# Altium project main.PrjPcb
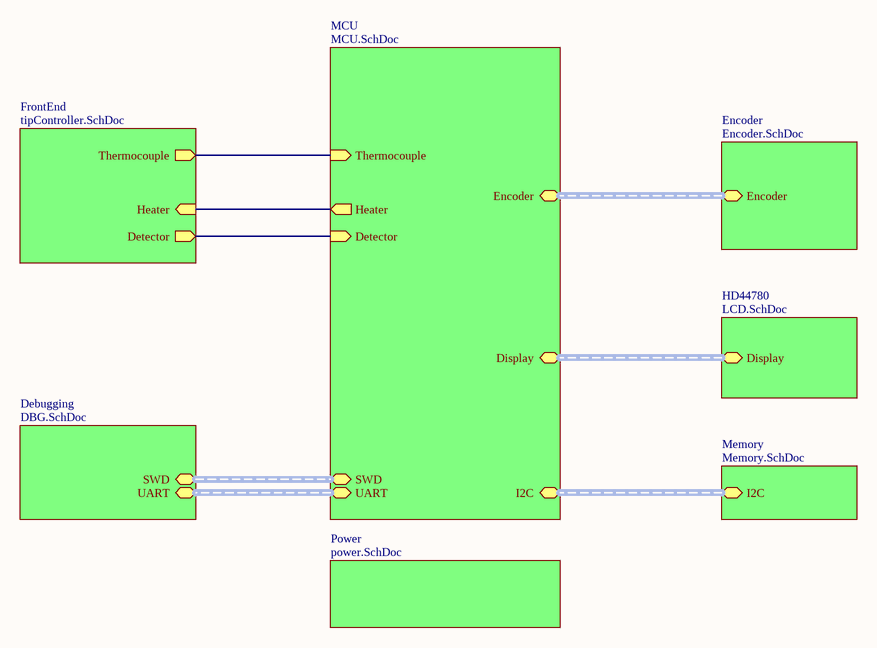
[diagram p0: top.SchDoc]
8 sheets, 80 parts. Net scope: hierarchical (ports join the sheet entries above them; power ports are global).
Board file: Main.PcbDoc
Sheets:
  top.SchDoc
    MCU = MCU.SchDoc
    Encoder = Encoder.SchDoc
    FrontEnd = tipController.SchDoc
    HD44780 = LCD.SchDoc
    Power = power.SchDoc
    Debugging = DBG.SchDoc
    Memory = Memory.SchDoc

## Sheet top.SchDoc: Weller RT soldering station
size A4; DrawnBy: Grzegorz Gajoch; Address1: Grzegorz Gajoch; Address2: grzegorz@gajoch.pl; Revision: 1

### Sub-sheets
Debugging = DBG.SchDoc: SWD (harness SWD), UART (harness UART)
Encoder = Encoder.SchDoc: Encoder (harness Encoder)
FrontEnd = tipController.SchDoc: Thermocouple (out), Heater (in), Detector (out)
HD44780 = LCD.SchDoc: Display (harness Display)
MCU = MCU.SchDoc: Display (harness Display), Thermocouple (in), Encoder (harness Encoder), Heater (out), SWD (harness SWD), UART (harness UART), Detector (in), I2C (harness I2C)
Memory = Memory.SchDoc: I2C (harness I2C)
Power = power.SchDoc: no entries

### Nets
NetC19_1: sheet MCU/Thermocouple, sheet FrontEnd/Thermocouple
NetR25_1: sheet MCU/Detector, sheet FrontEnd/Detector
NetR26_1: sheet MCU/Heater, sheet FrontEnd/Heater

### Buses and harness runs
harness sheet Debugging/SWD = sheet MCU/SWD
harness sheet Debugging/UART = sheet MCU/UART
harness sheet Encoder/Encoder = sheet MCU/Encoder
harness sheet HD44780/Display = sheet MCU/Display
harness sheet MCU/I2C = sheet Memory/I2C

### Notes on the sheet
- Title
- Size:
- Date:
- A4
- Number:
- Time:
- Revision:
- Sheet
- of
- File:

## Sheet MCU.SchDoc: MCU
size A4; DrawnBy: Grzegorz Gajoch; Address1: Grzegorz Gajoch; Address2: grzegorz@gajoch.pl; Revision: 1
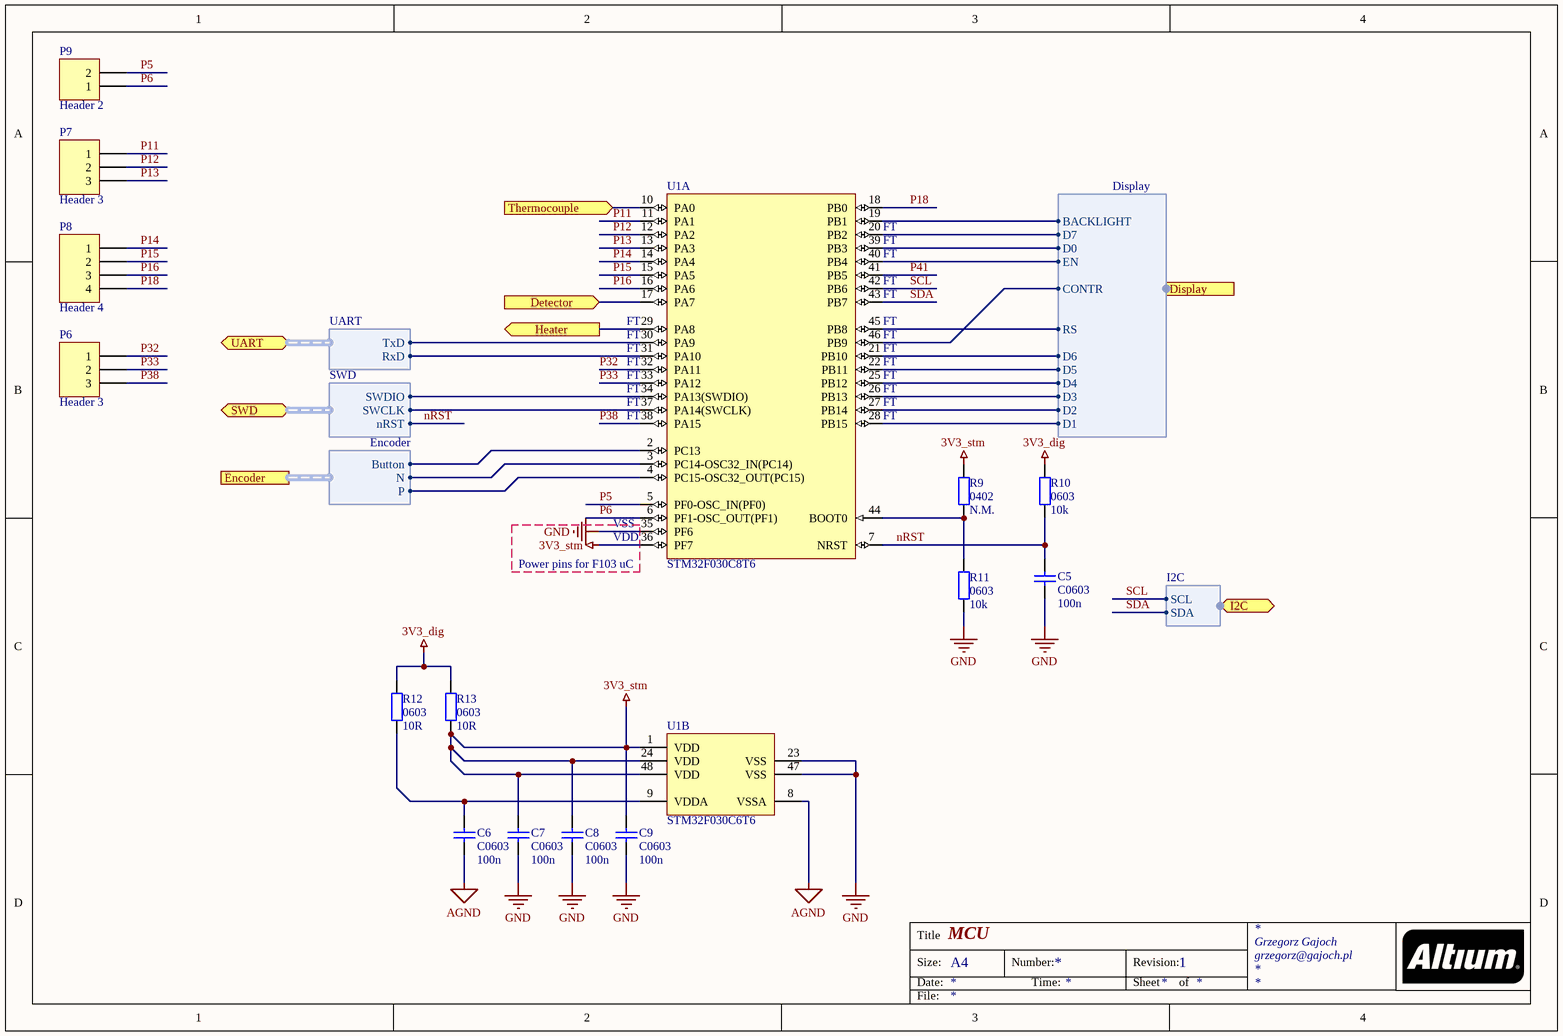
[diagram p1: MCU.SchDoc]

### Parts
C5  100n  [C0603]
C6  100n  [C0603]
C7  100n  [C0603]
C8  100n  [C0603]
C9  100n  [C0603]
P6  Header 3  [HEADER 1X3 MALE]
P7  Header 3  [HEADER 1X3 MALE]
P8  Header 4  [HEADER 1x4 MALE]
P9  Header 2  [HEADER 1X2 Male]
R9  N.M.  [0402]
R10  10k  [0603]
R11  10k  [0603]
R12  10R  [0603]
R13  10R  [0603]
U1  STM32F030C8T6  [QFP_48_0.5_M]  (parts A,B of 2)

### Ports
Detector (in), Display (harness Display), Encoder (harness Encoder), Heater (out), I2C (harness I2C), SWD (harness SWD), Thermocouple (in), UART (harness UART)

### Harnesses
SWD: SWDIO, SWCLK, nRST
Display: CONTR, RS, EN, D0, D1, D2, D3, D4, D5, D6, D7, BACKLIGHT
UART: RxD, TxD
Encoder: Button, P, N
I2C: SCL, SDA

### Nets
3V3_dig: R10.1 R12.1 R13.1
3V3_stm: C7.1 C8.1 C9.1 R9.1 R13.2 U1.1(VDD) U1.24(VDD) U1.36(PF7) U1.48(VDD)
AGND: C6.2 U1.8(VSSA)
GND: C5.2 C7.2 C8.2 C9.2 R11.2 U1.23(VSS) U1.35(PF6) U1.47(VSS)
BACK: U1.19(PB1) ; port Display.BACKLIGHT
BTN: U1.2(PC13) ; port Encoder.Button
D0: U1.39(PB3) ; port Display.D0
D1: U1.28(PB15) ; port Display.D1
D2: U1.27(PB14) ; port Display.D2
D3: U1.26(PB13) ; port Display.D3
D4: U1.25(PB12) ; port Display.D4
D5: U1.22(PB11) ; port Display.D5
D6: U1.21(PB10) ; port Display.D6
D7: U1.20(PB2) ; port Display.D7
ENx: U1.40(PB4) ; port Display.EN
nRST: C5.1 R10.2 U1.7(NRST) ; port SWD.nRST
P5: P9.2 U1.5(PF0-OSC_IN(PF0))
P6: P9.1 U1.6(PF1-OSC_OUT(PF1))
P11: P7.1 U1.11(PA1)
P12: P7.2 U1.12(PA2)
P13: P7.3 U1.13(PA3)
P14: P8.1 U1.14(PA4)
P15: P8.2 U1.15(PA5)
P16: P8.3 U1.16(PA6)
P18: P8.4 U1.18(PB0)
P32: P6.1 U1.32(PA11)
P33: P6.2 U1.33(PA12)
P38: P6.3 U1.38(PA15)
P41: U1.41(PB5)
RS: U1.45(PB8) ; port Display.RS
SCL: U1.42(PB6) ; port I2C.SCL
SDA: U1.43(PB7) ; port I2C.SDA
NetC1_1: U1.3(PC14-OSC32_IN(PC14)) ; port Encoder.N
NetC2_1: U1.4(PC15-OSC32_OUT(PC15)) ; port Encoder.P
NetC6_1: C6.1 R12.2 U1.9(VDDA)
NetC19_1: U1.10(PA0) ; port Thermocouple
NetP1_2: U1.31(PA10) ; port UART.RxD
NetP1_3: U1.30(PA9) ; port UART.TxD
NetP2_2: U1.37(PA14(SWCLK)) ; port SWD.SWCLK
NetP2_4: U1.34(PA13(SWDIO)) ; port SWD.SWDIO
NetR7_1: U1.46(PB9) ; port Display.CONTR
NetR9_2: R9.2 R11.1 U1.44(BOOT0)
NetR25_1: U1.17(PA7) ; port Detector
NetR26_1: U1.29(PA8) ; port Heater

### Notes on the sheet
- (near U1) FT
- (near U1) Power pins for F103 uC
- (near U1) VSS
- (near U1) VDD
- Title
- Size:
- Date:
- A4
- Number:
- Time:
- Revision:
- Sheet
- of
- File:

### Library data of the parts
C5-C9 = Cap: Generic capacitor; Packge: C0603; Value: 100n
P6 P7 = Header 3: Header, 3-Pin; LatestRevisionDate: 17-Jul-2002; LatestRevisionNote: Re-released for DXP Platform.; Publisher: Altium Limited
P8 = Header 4: Header, 4-Pin; LatestRevisionDate: 17-Jul-2002; LatestRevisionNote: Re-released for DXP Platform.; Publisher: Altium Limited
P9 = Header 2: Header, 2-Pin; LatestRevisionDate: 17-Jul-2002; LatestRevisionNote: Re-released for DXP Platform.; Publisher: Altium Limited
R9-R13 = Res: Generic resistor
  R9: Package: 0402; Value: N.M.
  R10 R11: Package: 0603; Value: 10k
  R12 R13: Package: 0603; Value: 10R
U1 = STM32F030C6T6: ARM Cortex-M0 32-bit MCU, 32 KB Flash, 4 KB Internal RAM, 39 I/Os, 48-pin LQFP, -40 to 85 degC, Tray; FLASH Size (Prog) (kB): 32; I/Os (High Current): 39; Internal RAM Size (kB): 4; Operating Frequency(F) (Processor speed) (MHz): 48; Supply Voltage(Vcc) min (V): 2.4; DatasheetVersion: Rev. 1; PackageVersion: Rev. 6, 06/2013; PackageReference: LQFP48; PackageDescription: 48-Pin Low Profile Quad Flat Package, 7 x 7 mm Body, 0.5 mm Pitch; Supplier 1: Digi-Key; Supplier Part Number 1: 497-14042-ND; Supplier 2: Newark; Supplier Part Number 2: 06X3646; Supplier 3: Mouser; Supplier Part Number 3: 511-STM32F030C6T6; Core: ARM Cortex-M0; Packing: Tray; Mounting Technology: Surface Mount; PartNumber: STM32F030C6T6; ComponentLink1Description: Manufacturer URL; ComponentLink1URL: http://www.st.com/web/en/home.html; ComponentLink2Description: Datasheet; ComponentLink2URL: http://www.st.com/st-web-ui/static/active/en/resource/technical/document/datasheet/DM00088500.pdf; ComponentLink3Description: Package Specification; ComponentLink3URL: http://www.st.com/st-web-ui/static/active/en/resource/technical/document/datasheet/DM00058181.pdf

## Sheet Encoder.SchDoc: Encoder connector
size A4; DrawnBy: Grzegorz Gajoch; Address1: Grzegorz Gajoch; Address2: grzegorz@gajoch.pl; Revision: 1
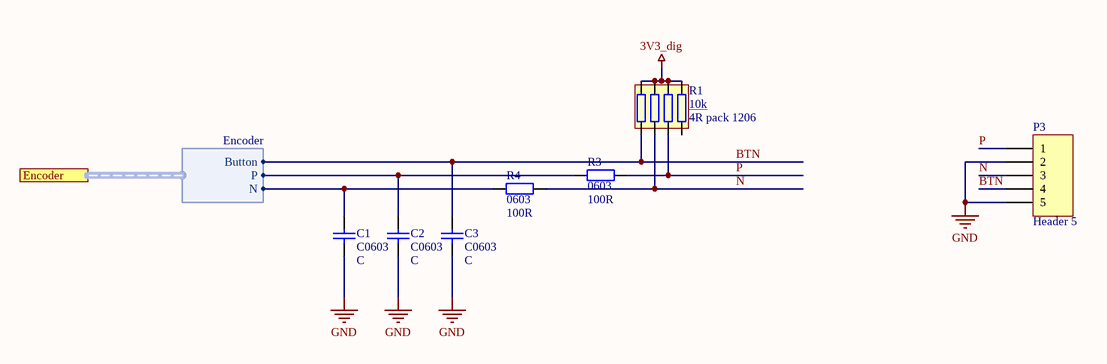
[diagram p2: Encoder.SchDoc]

### Parts
C1  C  [C0603]
C2  C  [C0603]
C3  C  [C0603]
P3  Header 5  [HDR1X5]
R1  10k  [4R pack 1206]
R3  100R  [0603]
R4  100R  [0603]

### Ports
Encoder (harness Encoder)

### Harnesses
Encoder: Button, P, N

### Nets
3V3_dig: R1.5 R1.6 R1.7 R1.8
GND: C1.2 C2.2 C3.2 P3.2 P3.5
BTN: C3.1 P3.4 R1.4 ; port Encoder.Button
N: P3.3 R1.3 R4.2
P: P3.1 R1.2 R3.2
NetC1_1: C1.1 R4.1 ; port Encoder.N
NetC2_1: C2.1 R3.1 ; port Encoder.P

Not connected (* = marked no-connect by the designer): R1 1

### Notes on the sheet
- Title
- Size:
- Date:
- A4
- Number:
- Time:
- Revision:
- Sheet
- of
- File:

### Library data of the parts
C1-C3 = Cap: Generic capacitor; Packge: C0603; Value: C
P3 = Header 5: Header, 5-Pin; LatestRevisionDate: 17-Jul-2002; LatestRevisionNote: Re-released for DXP Platform.; Publisher: Altium Limited
R1 = Rres_pack_4: 4 resistor pack array; Value: 10k; Package: 4R pack 1206
R3 R4 = Res: Generic resistor; Package: 0603; Value: 100R

## Sheet tipController.SchDoc: Weller RT controller analog
size A3; DrawnBy: Grzegorz Gajoch; Address1: Grzegorz Gajoch; Address2: grzegorz@gajoch.pl; Revision: 1
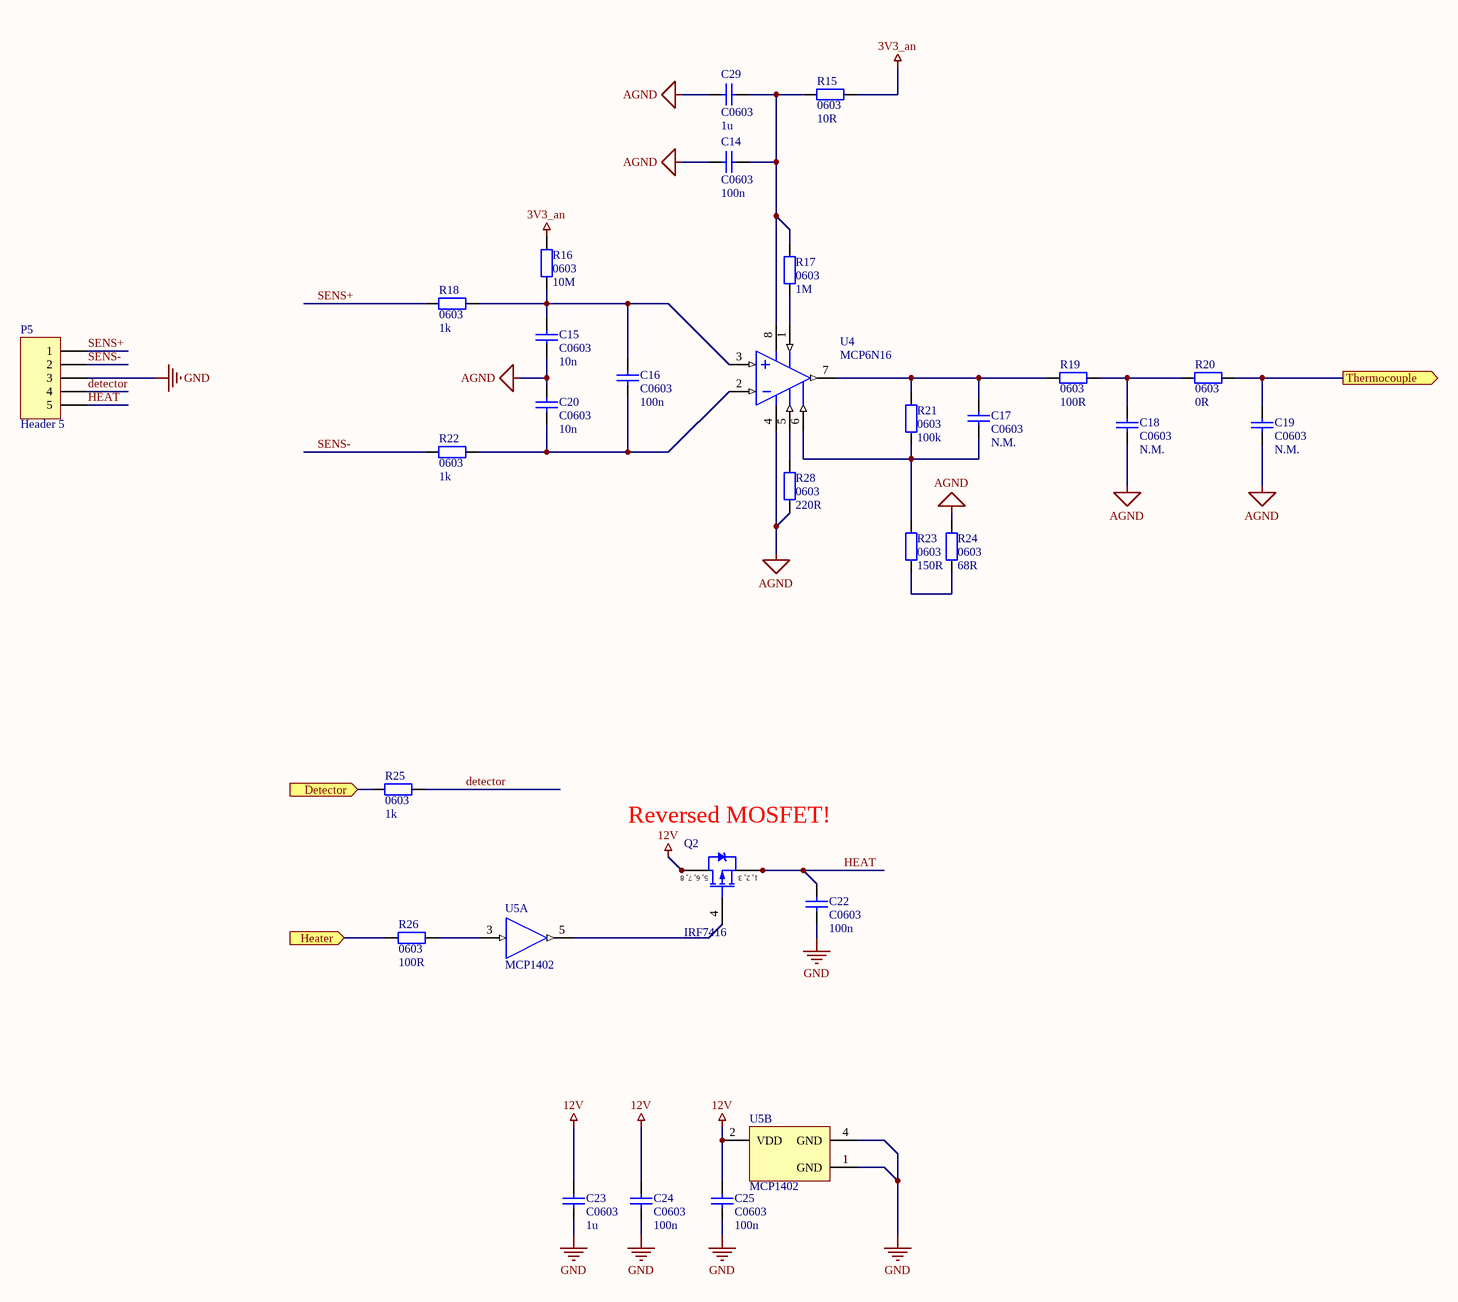
[diagram p3: tipController.SchDoc]

### Parts
C14  100n  [C0603]
C15  10n  [C0603]
C16  100n  [C0603]
C17  N.M.  [C0603]
C18  N.M.  [C0603]
C19  N.M.  [C0603]
C20  10n  [C0603]
C22  100n  [C0603]
C23  1u  [C0603]
C24  100n  [C0603]
C25  100n  [C0603]
C29  1u  [C0603]
P5  Header 5  [HDR1X5]
Q2  IRF7416  [SOIC-8_M]
R15  10R  [0603]
R16  10M  [0603]
R17  1M  [0603]
R18  1k  [0603]
R19  100R  [0603]
R20  0R  [0603]
R21  100k  [0603]
R22  1k  [0603]
R23  150R  [0603]
R24  68R  [0603]
R25  1k  [0603]
R26  100R  [0603]
R28  220R  [0603]
U4  MCP6N16  [MSOP-MS8_M]
U5  MCP1402  [SOT23-5_M]  (parts A,B of 2)

### Ports
Detector (in), Heater (in), Thermocouple (out)

### Nets
3V3_an: R15.1 R16.1
12V: C23.1 C24.1 C25.1 Q2.5(D) Q2.6(D) Q2.7(D) Q2.8(D) U5.2(VDD)
AGND: C14.1 C15.1 C18.2 C19.2 C20.1 C29.2 R24.2 R28.2 U4.4(VSS)
GND: C22.2 C23.2 C24.2 C25.2 P5.3 U5.1(GND) U5.4(GND)
detector: P5.4 R25.2
HEAT: C22.1 P5.5 Q2.1(S) Q2.2(S) Q2.3(S)
SENS+: P5.1 R18.1
SENS-: P5.2 R22.1
NetC14_2: C14.2 C29.1 R15.2 R17.1 U4.8(VDD)
NetC15_2: C15.2 C16.1 R16.2 R18.2 U4.3(VIN+)
NetC16_2: C16.2 C20.2 R22.2 U4.2(VIN-)
NetC17_1: C17.1 R19.1 R21.1 U4.7(VOUT)
NetC17_2: C17.2 R21.2 R23.1 U4.6(FB)
NetC18_1: C18.1 R19.2 R20.1
NetC19_1: C19.1 R20.2 ; port Thermocouple
NetQ2_4: Q2.4(G) U5.5(OUT)
NetR17_2: R17.2 U4.1(EN)
NetR23_2: R23.2 R24.1
NetR25_1: R25.1 ; port Detector
NetR26_1: R26.1 ; port Heater
NetR26_2: R26.2 U5.3(IN)
NetR28_1: R28.1 U4.5(Vref)

### Notes on the sheet
- (near Q2) Reversed MOSFET!
- Title
- Size:
- Date:
- A3
- Number:
- Time:
- Revision:
- Sheet
- of
- File:
- (in symbol IRF7416) 5, 6, 7, 8; 1, 2, 3

### Library data of the parts
C14-C20 C22-C25 C29 = Cap: Generic capacitor; Packge: C0603
  C14 C16 C22 C24 C25: Value: 100n
  C15 C20: Value: 10n
  C17-C19: Value: N.M.
  C23 C29: Value: 1u
P5 = Header 5: Header, 5-Pin; LatestRevisionDate: 17-Jul-2002; LatestRevisionNote: Re-released for DXP Platform.; Publisher: Altium Limited
Q2 = IRF7416: Power P-MOSFET; Published: 8-Jun-2000; LatestRevisionDate: 13-Apr-2006; LatestRevisionNote: IPC-7351 Footprint Added.; DatasheetVersion: Aug-1997; PackageVersion: Feb-2001; PackageReference: SO-8; Publisher: Altium Limited; PackageDescription: 8-Pin Plastic Small Outline Integrated Circuit 1.27 mm Pitch; Code_JEDEC: MS-012-AA; Code_IPC: SOIC127P600-8; ComponentLink1Description: Manufacturer Link; ComponentLink1URL: http://www.irf.com/; ComponentLink2Description: Datasheet; ComponentLink2URL: http://www.irf.com/product-info/datasheets/data/irf7416.pdf
R15-R26 R28 = Res: Generic resistor; Package: 0603
  R15: Value: 10R
  R16: Value: 10M
  R17: Value: 1M
  R18 R22 R25: Value: 1k
  R19 R26: Value: 100R
  R20: Value: 0R
  R21: Value: 100k
  R23: Value: 150R
  R24: Value: 68R
  R28: Value: 220R
U5 = MCP1402: MCP1402 MOSFET driver
U4 = MCP6N16: ComponentLink1URL: http://ww1.microchip.com/downloads/en/DeviceDoc/20005318A.pdf; ComponentLink1Description: Datasheet

## Sheet LCD.SchDoc: HD44780 display connector
size A4; DrawnBy: Grzegorz Gajoch; Address1: Grzegorz Gajoch; Address2: grzegorz@gajoch.pl; Revision: 1
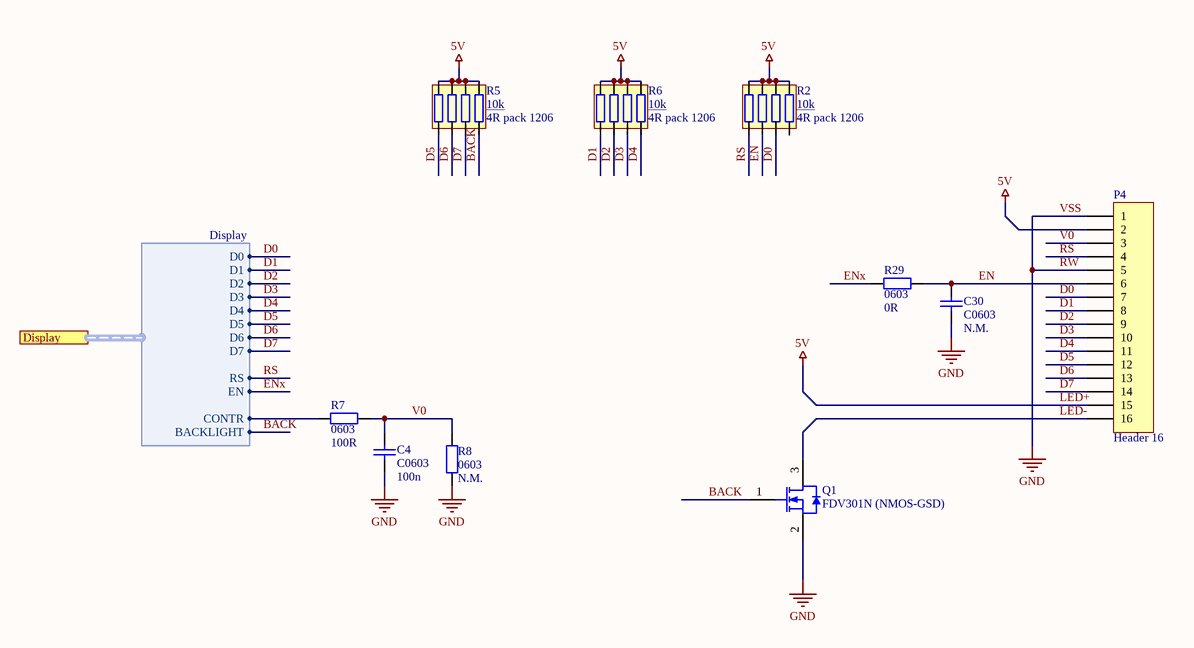
[diagram p4: LCD.SchDoc]

### Parts
C4  100n  [C0603]
C30  N.M.  [C0603]
P4  Header 16  [HEADER 1X16 Female]
Q1  FDV301N (NMOS-GSD)  [SOT-23_M]
R2  10k  [4R pack 1206]
R5  10k  [4R pack 1206]
R6  10k  [4R pack 1206]
R7  100R  [0603]
R8  N.M.  [0603]
R29  0R  [0603]

### Ports
Display (harness Display)

### Harnesses
Display: CONTR, RS, EN, D0, D1, D2, D3, D4, D5, D6, D7, BACKLIGHT

### Nets
GND: C4.2 C30.2 P4.1 P4.5 Q1.2(S) R8.2
LED+: P4.2 P4.15 R2.5 R2.6 R2.7 R2.8 R5.5 R5.6 R5.7 R5.8 R6.5 R6.6 R6.7 R6.8  [also labelled 5V]
BACK: Q1.1(G) R5.4 ; port Display.BACKLIGHT
D0: P4.7 R2.3 ; port Display.D0
D1: P4.8 R6.1 ; port Display.D1
D2: P4.9 R6.2 ; port Display.D2
D3: P4.10 R6.3 ; port Display.D3
D4: P4.11 R6.4 ; port Display.D4
D5: P4.12 R5.1 ; port Display.D5
D6: P4.13 R5.2 ; port Display.D6
D7: P4.14 R5.3 ; port Display.D7
EN: C30.1 P4.6 R2.2 R29.2
ENx: R29.1 ; port Display.EN
LED-: P4.16 Q1.3(D)
RS: P4.4 R2.1 ; port Display.RS
V0: C4.1 P4.3 R7.2 R8.1
NetR7_1: R7.1 ; port Display.CONTR

Not connected (* = marked no-connect by the designer): R2 4

### Notes on the sheet
- (near P4) VSS
- (near P4) RW
- Title
- Size:
- Date:
- A4
- Number:
- Time:
- Revision:
- Sheet
- of
- File:

### Library data of the parts
C4 C30 = Cap: Generic capacitor; Packge: C0603
  C4: Value: 100n
  C30: Value: N.M.
P4 = Header 16: Header, 16-Pin; LatestRevisionDate: 17-Jul-2002; LatestRevisionNote: Re-released for DXP Platform.; Publisher: Altium Limited
Q1 = NMOS-GSD
R2 R5 R6 = Rres_pack_4: 4 resistor pack array; Value: 10k; Package: 4R pack 1206
R7 R8 R29 = Res: Generic resistor; Package: 0603
  R7: Value: 100R
  R8: Value: N.M.
  R29: Value: 0R

## Sheet power.SchDoc: Power distribution
size A4; DrawnBy: Grzegorz Gajoch; Address1: Grzegorz Gajoch; Address2: grzegorz@gajoch.pl; Revision: 1
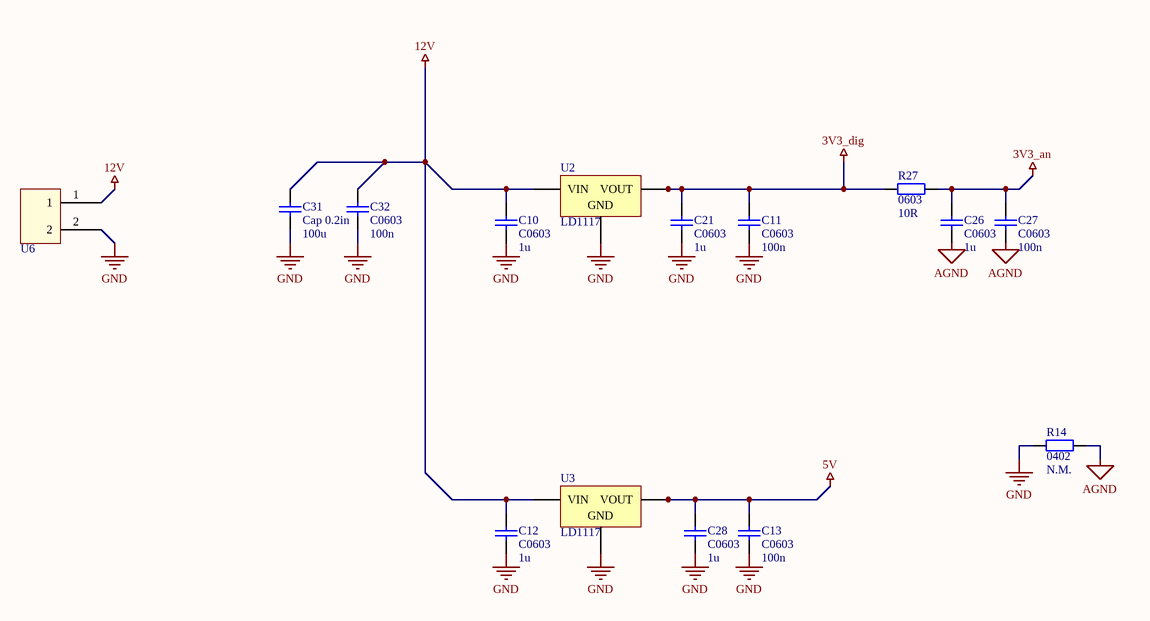
[diagram p5: power.SchDoc]

### Parts
C10  1u  [C0603]
C11  100n  [C0603]
C12  1u  [C0603]
C13  100n  [C0603]
C21  1u  [C0603]
C26  1u  [C0603]
C27  100n  [C0603]
C28  1u  [C0603]
C31  100u  [Cap 0.2in]
C32  100n  [C0603]
R14  N.M.  [0402]
R27  10R  [0603]
U2  LD1117  [TO-252]
U3  LD1117  [TO-252]
U6  ARK Terminal Block; 2-pin  [ARK2]  (value not drawn)

### Nets
3V3_an: C26.1 C27.1 R27.2
3V3_dig: C11.1 C21.1 R27.1 U2.2(VOUT) U2.4(VOUT) U2.5(VOUT) U2.6(VOUT)
5V: C13.1 C28.1 U3.2(VOUT) U3.4(VOUT) U3.5(VOUT) U3.6(VOUT)  [project net LED+]
12V: C10.1 C12.1 C31.1 C32.1 U2.3(VIN) U3.3(VIN) U6.1
AGND: C26.2 C27.2 R14.2
GND: C10.2 C11.2 C12.2 C13.2 C21.2 C28.2 C31.2 C32.2 R14.1 U2.1(GND) U3.1(GND) U6.2

### Notes on the sheet
- Title
- Size:
- Date:
- A4
- Number:
- Time:
- Revision:
- Sheet
- of
- File:

### Library data of the parts
C10-C13 C21 C26-C28 C31 C32 = Cap: Generic capacitor
  C10 C12 C21 C26 C28: Packge: C0603; Value: 1u
  C11 C13 C27 C32: Packge: C0603; Value: 100n
  C31: Packge: Cap 0.2in; Value: 100u
R14 R27 = Res: Generic resistor
  R14: Package: 0402; Value: N.M.
  R27: Package: 0603; Value: 10R
U2 U3 = LD1117: Low drop positive voltage regulator; pin to pad: 2>4 5>4 6>4; ComponentLink1URL: http://www.st.com/web/en/resource/technical/document/datasheet/CD00000544.pdf; ComponentLink1Description: Datasheet

## Sheet DBG.SchDoc: Debug connectors
size A4; DrawnBy: Grzegorz Gajoch; Address1: Grzegorz Gajoch; Address2: grzegorz@gajoch.pl; Revision: 1
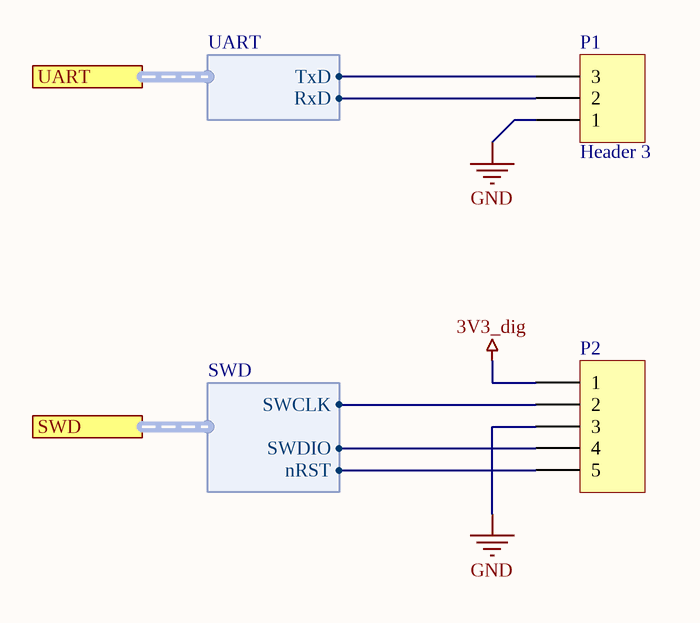
[diagram p6: DBG.SchDoc]

### Parts
P1  Header 3  [HEADER1X3H Male]
P2  Header 5  [HDR1X5]  (value not drawn)

### Ports
SWD (harness SWD), UART (harness UART)

### Harnesses
SWD: SWDIO, SWCLK, nRST
UART: RxD, TxD

### Nets
3V3_dig: P2.1
GND: P1.1 P2.3
nRST: P2.5 ; port SWD.nRST
NetP1_2: P1.2 ; port UART.RxD
NetP1_3: P1.3 ; port UART.TxD
NetP2_2: P2.2 ; port SWD.SWCLK
NetP2_4: P2.4 ; port SWD.SWDIO

### Notes on the sheet
- Title
- Size:
- Date:
- A4
- Number:
- Time:
- Revision:
- Sheet
- of
- File:

### Library data of the parts
P1 = Header 3: Header, 3-Pin; LatestRevisionDate: 17-Jul-2002; LatestRevisionNote: Re-released for DXP Platform.; Publisher: Altium Limited
P2 = Header 5: Header, 5-Pin; LatestRevisionDate: 17-Jul-2002; LatestRevisionNote: Re-released for DXP Platform.; Publisher: Altium Limited

## Sheet Memory.SchDoc: I2C memory
size A4; DrawnBy: Grzegorz Gajoch; Address1: Grzegorz Gajoch; Address2: grzegorz@gajoch.pl; Revision: 1
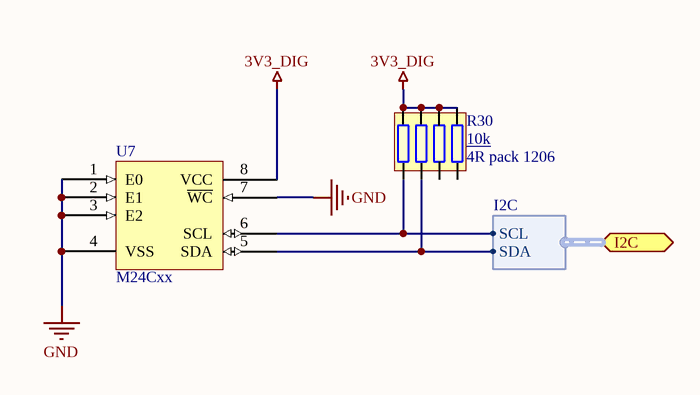
[diagram p7: Memory.SchDoc]

### Parts
R30  10k  [4R pack 1206]
U7  M24Cxx  [SOIC-8_M]

### Ports
I2C (harness I2C)

### Harnesses
I2C: SCL, SDA

### Nets
3V3_dig: R30.5 R30.6 R30.7 R30.8 U7.8(VCC)
GND: U7.1(E0) U7.2(E1) U7.3(E2) U7.4(VSS) U7.7(~{WC})
SCL: R30.1 U7.6(SCL) ; port I2C.SCL
SDA: R30.2 U7.5(SDA) ; port I2C.SDA

Not connected (* = marked no-connect by the designer): R30 3 4

### Notes on the sheet
- Title
- Size:
- Date:
- A4
- Number:
- Time:
- Revision:
- Sheet
- of
- File:

### Library data of the parts
R30 = Rres_pack_4: 4 resistor pack array; Value: 10k; Package: 4R pack 1206
U7 = M24Cxx: M24Cxx flash memory; ComponentLink1URL: http://www.tme.eu/pl/Document/219e6bd9acfc60fea157d9c160868c29/m24c08-w.pdf; ComponentLink1Description: Datasheet

## Nets that join several sheets
3V3_an: tipController (R15.1 R16.1), power (C26.1 C27.1 R27.2)
3V3_dig: MCU (R10.1 R12.1 R13.1), Encoder (R1.5 R1.6 R1.7 R1.8), power (7 pins), DBG (P2.1), Memory (5 pins)
12V: tipController (8 pins), power (7 pins)
AGND: MCU (C6.2 U1.8), tipController (9 pins), power (C26.2 C27.2 R14.2)
GND: MCU (8 pins), Encoder (5 pins), tipController (7 pins), LCD (6 pins), power (12 pins), DBG (P1.1 P2.3), Memory (5 pins)
LED+: LCD (14 pins), power (6 pins)
BACK: MCU (U1.19), LCD (Q1.1 R5.4)
BTN: MCU (U1.2), Encoder (C3.1 P3.4 R1.4)
D0: MCU (U1.39), LCD (P4.7 R2.3)
D1: MCU (U1.28), LCD (P4.8 R6.1)
D2: MCU (U1.27), LCD (P4.9 R6.2)
D3: MCU (U1.26), LCD (P4.10 R6.3)
D4: MCU (U1.25), LCD (P4.11 R6.4)
D5: MCU (U1.22), LCD (P4.12 R5.1)
D6: MCU (U1.21), LCD (P4.13 R5.2)
D7: MCU (U1.20), LCD (P4.14 R5.3)
ENx: MCU (U1.40), LCD (R29.1)
NetC1_1: MCU (U1.3), Encoder (C1.1 R4.1)
NetC2_1: MCU (U1.4), Encoder (C2.1 R3.1)
NetC19_1: MCU (U1.10), tipController (C19.1 R20.2)
NetP1_2: MCU (U1.31), DBG (P1.2)
NetP1_3: MCU (U1.30), DBG (P1.3)
NetP2_2: MCU (U1.37), DBG (P2.2)
NetP2_4: MCU (U1.34), DBG (P2.4)
NetR7_1: MCU (U1.46), LCD (R7.1)
NetR25_1: MCU (U1.17), tipController (R25.1)
NetR26_1: MCU (U1.29), tipController (R26.1)
nRST: MCU (C5.1 R10.2 U1.7), DBG (P2.5)
RS: MCU (U1.45), LCD (P4.4 R2.1)
SCL: MCU (U1.42), Memory (R30.1 U7.6)
SDA: MCU (U1.43), Memory (R30.2 U7.5)